# Altium schematic sheet 温度湿度测量.SchDoc
size A4; Organization: Altium Limited; Address1: L3, 12a Rodborough Rd; Address2: Frenchs Forest; Address3: NSW; Address4: Australia 2086
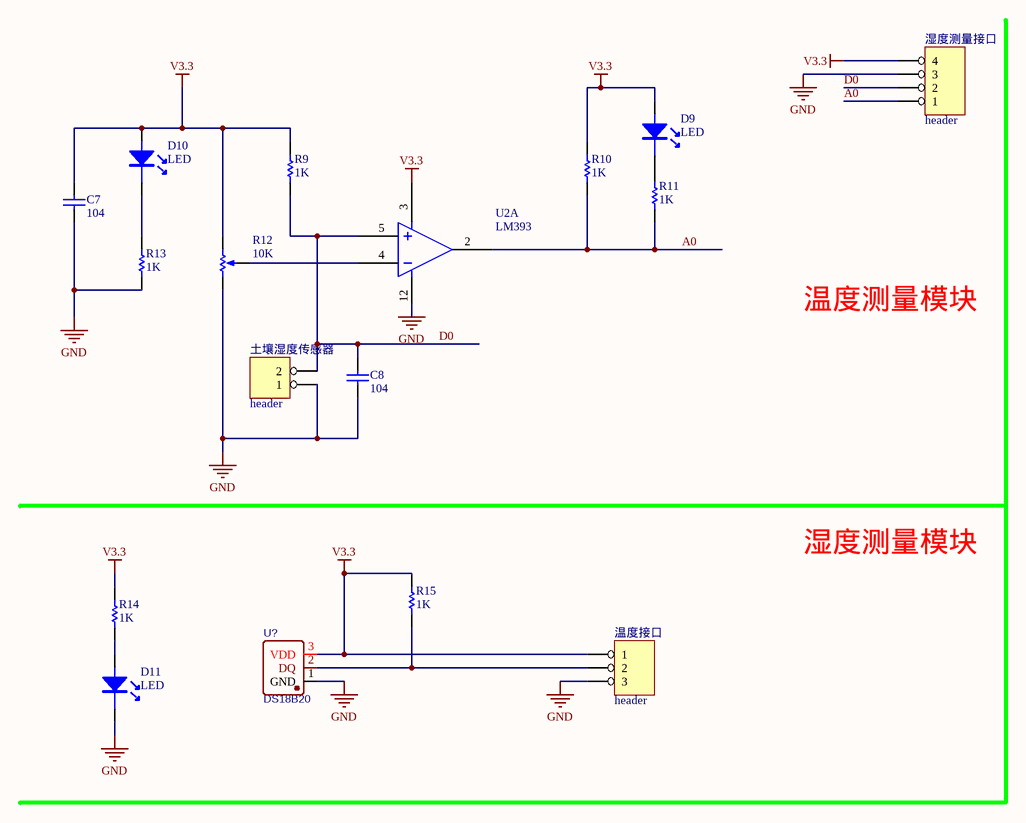
[diagram p0: 温度湿度测量.SchDoc]

## Parts
C7  104  [0603_C]
C8  104  [0603_C]
D9  LED  [0805_LED]
D10  LED  [0805_LED]
D11  LED  [0805_LED]
R9  1K  [0805_r]
R10  1K  [0805_r]
R11  1K  [0805_r]
R12  10K  [Rpot_单联]
R13  1K  [0805_r]
R14  1K  [0805_r]
R15  1K  [0805_r]
U2  LM393  [DIP-14]  (part A of 4)
U?  DS18B20  [TO-92-3_L4.9-W3.7-P1.27-L]
土壤湿度传感器  header  [header2]
温度接口  header  [header3]
湿度测量接口  header  [header4]

## Nets
GND: C7.1 C8.1 D11.2(K) R12.3(TOP) R13.1 U2.12 U?.1(GND) 土壤湿度传感器.1 温度接口.3 湿度测量接口.3
V3.3: C7.2 D9.1(A) D10.1(A) R9.2 R10.2 R12.1(BOT) R14.2 R15.2 U2.3 U?.3(VDD) 温度接口.1 湿度测量接口.4
A0: R10.1 R11.1 U2.2 湿度测量接口.1
D0: C8.2 R9.1 U2.5 土壤湿度传感器.2 湿度测量接口.2
NetD9_2: D9.2(K) R11.2
NetD10_2: D10.2(K) R13.2
NetD11_1: D11.1(A) R14.1
NetR12_2: R12.2(TAP) U2.4
NetR15_1: R15.1 U?.2(DQ) 温度接口.2

## Notes on the sheet
- 温度测量模块
- 湿度测量模块
- Title
- Size:
- Date:
- A4
- Number:
- Time:
- Revision:
- Sheet
- of
- File:

## Library data of the parts
C7 C8 = CAP: Capacitor; Published: 8-Jun-2000; LatestRevisionDate: 17-Jul-2002; LatestRevisionNote: Re-released for DXP Platform.; PackageReference: RAD-0.3; Publisher: Altium Limited; Value: 104
D9-D11 = LED: LED 发光二极管
R9-R11 R13-R15 = RES: Resistor; Published: 8-Jun-2000; Revision: July-2002: Re-released for DXP Platform.; Publisher: Altium Limited; Value: 1K
R12 = 单联电位器
U2 = LM339A
U? = DS18B20: BOM_Manufacturer: Youtai Semiconductor Co., Ltd.; Contributor: LCSC; BOM_Supplier: LCSC; BOM_Supplier Part: C376006; BOM_Manufacturer Part: DS18B20; spicePre: U; spiceSymbolName: DS18B20
土壤湿度传感器 = HEADER 2
温度接口 = HEADER 3
湿度测量接口 = HEADER 4